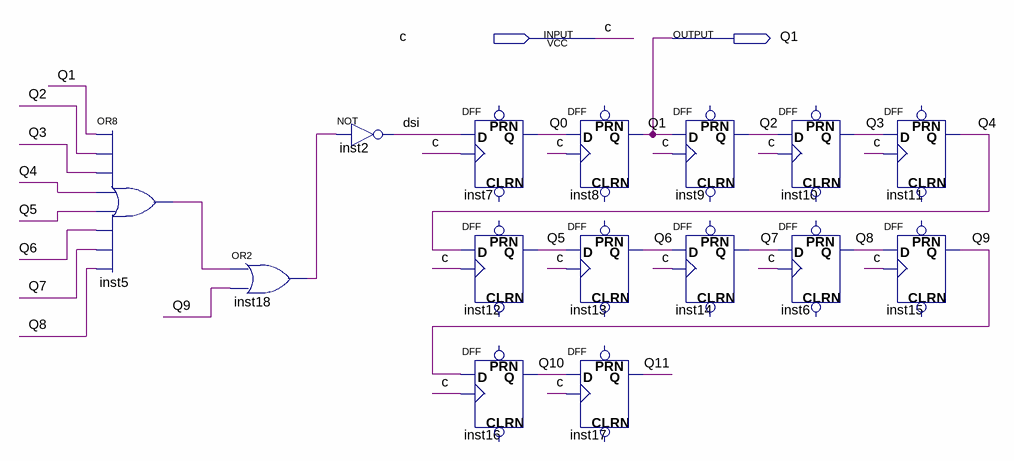
[diagram p0: schematic sheet]
// Quartus schematic 5.bdf as structural Verilog: 15 symbols, 2 pins
module \5  (
  input  c,
  output Q1
);

  wire dsi, inst5_out, inst18_out, Q0, Q2, Q3, Q4, Q5, Q6, Q7, Q8, Q9, Q10, Q11;

  or inst5 (inst5_out, Q1, Q2, Q3, Q4, Q5, Q6, Q7, Q8);
  or inst18 (inst18_out, inst5_out, Q9);
  not inst2 (dsi, inst18_out);
  DFF inst7 (.CLK(c), .D(dsi), .Q(Q0));  // open: CLRN, PRN
  DFF inst12 (.CLK(c), .D(Q4), .Q(Q5));  // open: CLRN, PRN
  DFF inst16 (.CLK(c), .D(Q9), .Q(Q10));  // open: CLRN, PRN
  DFF inst8 (.CLK(c), .D(Q0), .Q(Q1));  // open: CLRN, PRN
  DFF inst13 (.CLK(c), .D(Q5), .Q(Q6));  // open: CLRN, PRN
  DFF inst17 (.CLK(c), .D(Q10), .Q(Q11));  // open: CLRN, PRN
  DFF inst9 (.CLK(c), .D(Q1), .Q(Q2));  // open: CLRN, PRN
  DFF inst14 (.CLK(c), .D(Q6), .Q(Q7));  // open: CLRN, PRN
  DFF inst10 (.CLK(c), .D(Q2), .Q(Q3));  // open: CLRN, PRN
  DFF inst6 (.CLK(c), .D(Q7), .Q(Q8));  // open: CLRN, PRN
  DFF inst11 (.CLK(c), .D(Q3), .Q(Q4));  // open: CLRN, PRN
  DFF inst15 (.CLK(c), .D(Q8), .Q(Q9));  // open: CLRN, PRN
endmodule
